# EAGLE design TouchPanel_ver _5 (EAGLE 6.1)
Master board. Prototype version 1.0
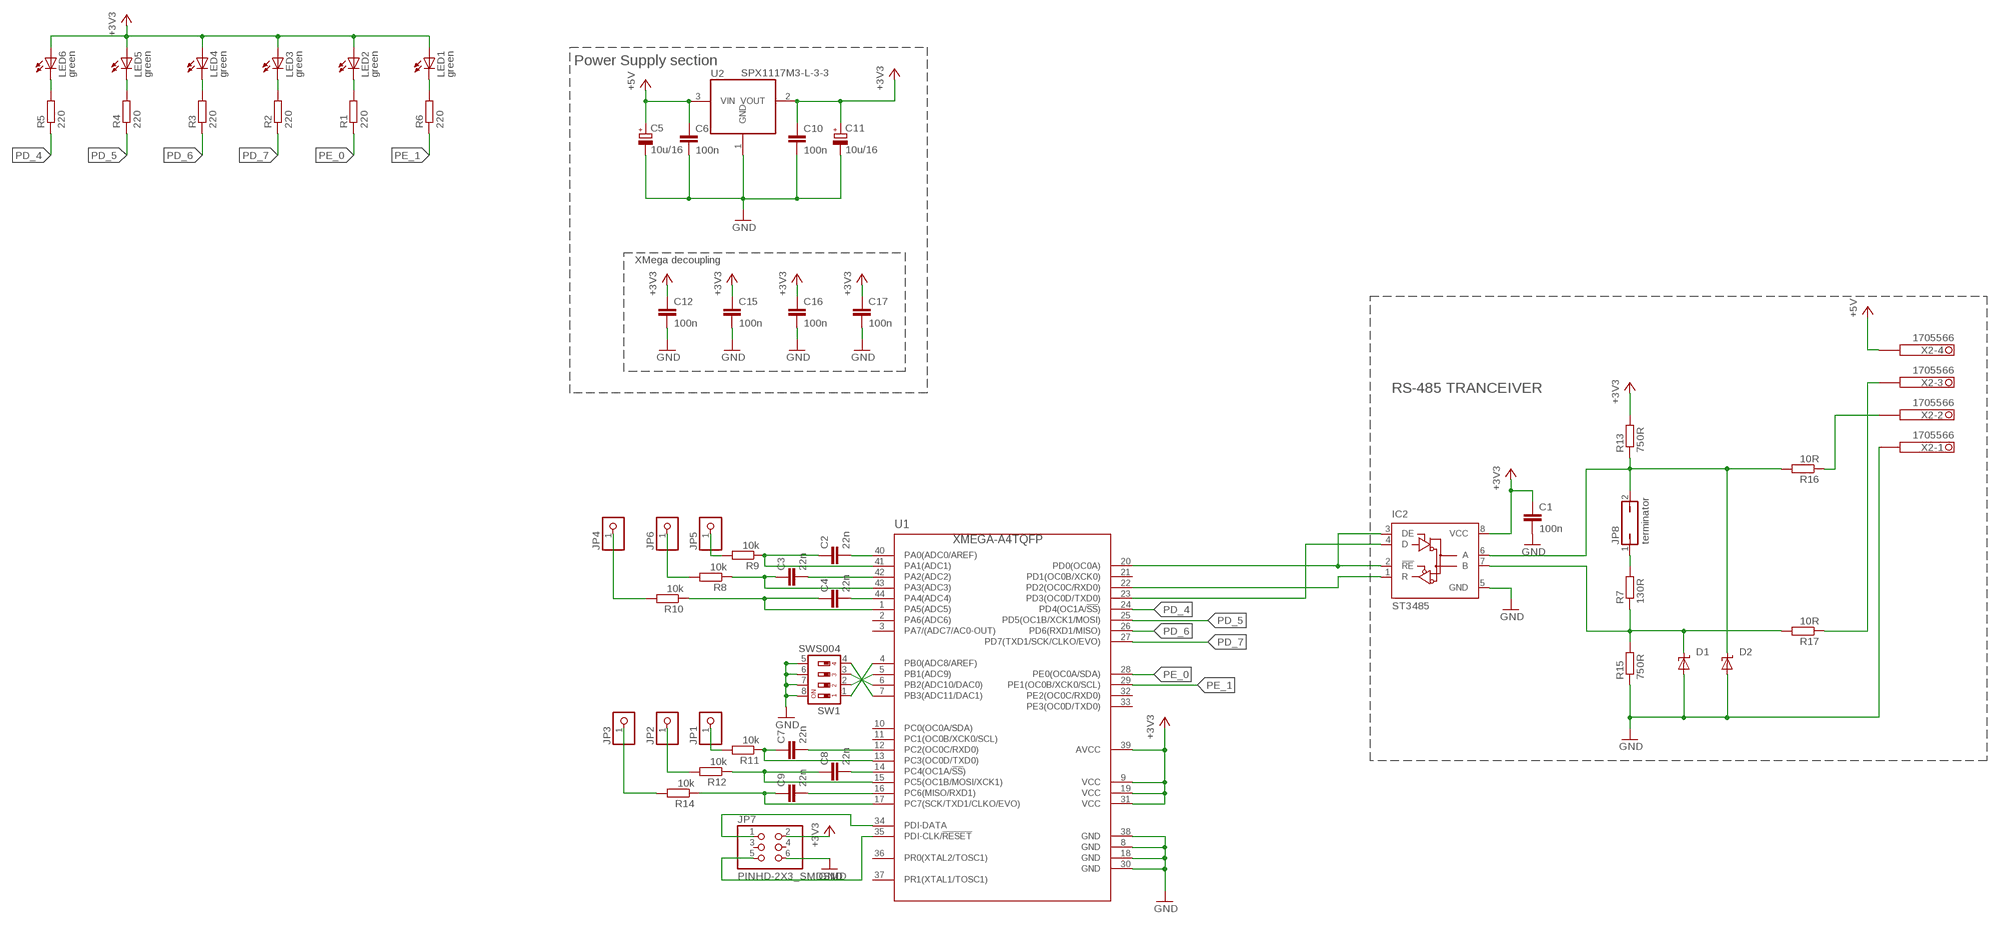
[diagram p0: schematic, sheet 1]

## Parts
C1  100n  C-EUC1206  [C1206]
C2  22n  C-EUC1206  [C1206]
C3  22n  C-EUC1206  [C1206]
C4  22n  C-EUC1206  [C1206]
C5  10u/16  CPOL-EUSMCB  [SMC_B]
C6  100n  C-EUC1206  [C1206]
C7  22n  C-EUC1206  [C1206]
C8  22n  C-EUC1206  [C1206]
C9  22n  C-EUC1206  [C1206]
C10  100n  C-EUC1206  [C1206]
C11  10u/16  CPOL-EUSMCB  [SMC_B]
C12  100n  C-EUC1206  [C1206]
C15  100n  C-EUC1206  [C1206]
C16  100n  C-EUC1206  [C1206]
C17  100n  C-EUC1206  [C1206]
D1  SUPPRESSOR-SMBJ  [SMBJ]
D2  SUPPRESSOR-SMBJ  [SMBJ]
IC2  ST3485  75176AD  [D_R-PDSO-G8]
JP1  PINHD-1X1  [1X01]
JP2  PINHD-1X1  [1X01]
JP3  PINHD-1X1  [1X01]
JP4  PINHD-1X1  [1X01]
JP5  PINHD-1X1  [1X01]
JP6  PINHD-1X1  [1X01]
JP7  PINHD-2X3_SMDSMD  [2X03_SMD]
JP8  terminator  JP1Q  [JP1]
LED1  green  LEDTOPLED-SANTANA  [MINI-TOPLED-SANTANA]
LED2  green  LEDTOPLED-SANTANA  [MINI-TOPLED-SANTANA]
LED3  green  LEDTOPLED-SANTANA  [MINI-TOPLED-SANTANA]
LED4  green  LEDTOPLED-SANTANA  [MINI-TOPLED-SANTANA]
LED5  green  LEDTOPLED-SANTANA  [MINI-TOPLED-SANTANA]
LED6  green  LEDTOPLED-SANTANA  [MINI-TOPLED-SANTANA]
R1  220  R-EU_M1206  [M1206]
R2  220  R-EU_M1206  [M1206]
R3  220  R-EU_R1206  [R1206]
R4  220  R-EU_R1206  [R1206]
R5  220  R-EU_R1206  [R1206]
R6  220  R-EU_M1206  [M1206]
R7  130R  R-EU_M1206  [M1206]
R8  10k  R-EU_R1206  [R1206]
R9  10k  R-EU_R1206  [R1206]
R10  10k  R-EU_R1206  [R1206]
R11  10k  R-EU_R1206  [R1206]
R12  10k  R-EU_R1206  [R1206]
R13  750R  R-EU_M1206  [M1206]
R14  10k  R-EU_R1206  [R1206]
R15  750R  R-EU_M1206  [M1206]
R16  10R  R-EU_M1206  [M1206]
R17  10R  R-EU_M1206  [M1206]
SW1  SWS004  [SMS-004]
U1  XMEGA-A4TQFP  [TQFP44]
U2  SPX1117M3-L-3-3  REG1117  [SOT223]
X2  1705566  [1705566]

## Nets
+3V3: C1.1 C10.1 C11.+ C12.1 C15.1 C16.1 C17.1 IC2.8(VCC) JP7.2 LED1.A LED2.A LED3.A LED4.A LED5.A LED6.A R13.2 U1.9(VCC) U1.19(VCC) U1.31(VCC) U1.39(AVCC) U2.2(VOUT)
+5V: C5.+ C6.1 U2.3(VIN) X2.4.2(-4:1B)
GND: C1.2 C5.- C6.2 C10.2 C11.- C12.2 C15.2 C16.2 C17.2 D1.A D2.A IC2.5(GND) JP7.6 R15.1 SW1.5 SW1.6 SW1.7 SW1.8 U1.8(GND) U1.18(GND) U1.30(GND) U1.38(GND) U2.1(GND) X2.1.2(-1:1B)
JP4: JP4.1 R10.2
N$1: LED2.C R1.2
N$2: LED3.C R2.2
N$3: LED4.C R3.2
N$4: LED5.C R4.2
N$5: LED6.C R5.2
N$6: R17.1 X2.3.2(-3:1B)
N$7: JP8.1 R7.2
N$8: R16.1 X2.2.2(-2:1B)
N$9: D1.C IC2.7(B) R7.1 R15.2 R17.2
N$10: JP7.1 U1.34(PDI-DATA)
N$11: JP7.5 U1.35(PDI-CLK/!RESET)
N$12: LED1.C R6.2
N$13: C2.1 R9.1 U1.41(PA1(ADC1))
N$14: C2.2 U1.40(PA0(ADC0/AREF))
N$15: C9.2 U1.16(PC6(MISO/RXD1))
N$16: C3.1 R8.1 U1.43(PA3(ADC3))
N$17: C8.2 U1.14(PC4(OC1A/!SS!))
N$18: C4.1 R10.1 U1.1(PA5(ADC5))
N$20: C7.2 U1.12(PC2(OC0C/RXD0))
N$21: C9.1 R14.1 U1.17(PC7(SCK/TXD1/CLKO/EVO))
N$22: SW1.1 U1.4(PB0(ADC8/AREF))
N$23: SW1.4 U1.7(PB3(ADC11/DAC1))
N$24: SW1.2 U1.5(PB1(ADC9))
N$25: SW1.3 U1.6(PB2(ADC10/DAC0))
N$26: C8.1 R12.1 U1.15(PC5(OC1B/MOSI/XCK1))
N$27: C3.2 U1.42(PA2(ADC2))
N$28: C7.1 R11.1 U1.13(PC3(OC0D/TXD0))
N$29: C4.2 U1.44(PA4(ADC4))
N$30: JP1.1 R11.2
N$31: JP2.1 R12.2
N$32: JP3.1 R14.2
N$33: JP6.1 R8.2
N$35: JP5.1 R9.2
PD_0: IC2.2(!RE) IC2.3(DE) U1.20(PD0(OC0A))
PD_2: IC2.1(R) U1.22(PD2(OC0C/RXD0))
PD_3: IC2.4(D) U1.23(PD3(OC0D/TXD0))
PD_4: R5.1 U1.24(PD4(OC1A/!SS!))
PD_5: R4.1 U1.25(PD5(OC1B/XCK1/MOSI))
PD_6: R3.1 U1.26(PD6(RXD1/MISO))
PD_7: R2.1 U1.27(PD7(TXD1/SCK/CLKO/EVO))
PE_0: R1.1 U1.28(PE0(OC0A/SDA))
PE_1: R6.1 U1.29(PE1(OC0B/XCK0/SCL))
RS485_A1: D2.C IC2.6(A) JP8.2 R13.1 R16.2
Unconnected: JP7.3 JP7.4 U1.2(PA6(ADC6)) U1.3(PA7/(ADC7/AC0-OUT)) U1.10(PC0(OC0A/SDA)) U1.11(PC1(OC0B/XCK0/SCL)) U1.21(PD1(OC0B/XCK0)) U1.32(PE2(OC0C/RXD0)) U1.33(PE3(OC0D/TXD0)) U1.36(PR0(XTAL2/TOSC1)) U1.37(PR1(XTAL1/TOSC1)) X2.1.1(-1:1A) X2.2.1(-2:1A) X2.3.1(-3:1A) X2.4.1(-4:1A)

## Notes on the sheet
- Power Supply section
- XMega decoupling
- RS-485 TRANCEIVER

## Library data of the parts
C1-C4 C6-C10 C12 C15-C17 = rcl:C-EU: CAPACITOR, European symbol
C5 C11 = rcl:CPOL-EU: POLARIZED CAPACITOR, European symbol
D1 D2 = diode:SUPPRESSOR-: Suppressor diode
IC2 = 751xx:75176A: DIFFERENTIAL BUS TRANSCEIVER Source: http://focus.ti.com/lit/ds/symlink/sn75176a.pdf
JP1-JP6 = pinhead:PINHD-1X1: PIN HEADER
JP7 = pinhead:PINHD-2X3_SMD
JP8 = jumper:JP1Q: JUMPER
LED1-LED6 = led:LED: LED OSRAM: - CHIPLED LG R971, LG N971, LY N971, LG Q971, LY Q971, LO R971, LY R971 LH N974, LH R974 LS Q976, LO Q976, LY Q976 LO Q996 - Hyper CHIPLED LW Q18S LB Q993, LB Q99A, LB R99A - SideLED LS A670, LO A670, LY A670, LG A670, LP A670 LB A673, LV A673, LT A673, LW A673 LH A674 LY A675 LS A676, LA A676, LO A676, LY A676, LW A676 LS A679, LY A679, LG A679 - Hyper Micro SIDELED® LS Y876, LA Y876, LO Y876, LY Y876 LT Y87S - SmartLED LW L88C, LW L88S LB L89C, LB L89S, LG L890 LS L89K, LO L89K, LY L89K LS L896, LA L896, LO L896, LY L896 - TOPLED LS T670, LO T670, LY T670, LG T670, LP T670 LSG T670, LSP T670, LSY T670, LOP T670, LYG T670 LG T671, LOG T671, LSG T671 LB T673, LV T673, LT T673, LW T673 LH T674 LS T676, LA T676, LO T676, LY T676, LB T676, LH T676, LSB T676, LW T676 LB T67C, LV T67C, LT T67C, LS T67K, LO T67K, LY T67K, LW E67C LS E67B, LA E67B, LO E67B, LY E67B, LB E67C, LV E67C, LT E67C LW T67C LS T679, LY T679, LG T679 LS T770, LO T770, LY T770, LG T770, LP T770 LB T773, LV T773, LT T773, LW T773 LH T774 LS E675, LA E675, LY E675, LS T675 LS T776, LA T776, LO T776, LY T776, LB T776 LHGB T686 LT T68C, LB T68C - Hyper Mini TOPLED® LB M676 - Mini TOPLED Santana® LG M470 LS M47K, LO M47K, LY M47K Source: http://www.osram.convergy.de LUXEON: - LUMILED® LXK2-PW12-R00, LXK2-PW12-S00, LXK2-PW14-U00, LXK2-PW14-V00 LXK2-PM12-R00, LXK2-PM12-S00, LXK2-PM14-U00 LXK2-PE12-Q00, LXK2-PE12-R00, LXK2-PE12-S00, LXK2-PE14-T00, LXK2-PE14-U00 LXK2-PB12-K00, LXK2-PB12-L00, LXK2-PB12-M00, LXK2-PB14-N00, LXK2-PB14-P00, LXK2-PB14-Q00 LXK2-PR12-L00, LXK2-PR12-M00, LXK2-PR14-Q00, LXK2-PR14-R00 LXK2-PD12-Q00, LXK2-PD12-R00, LXK2-PD12-S00 LXK2-PH12-R00, LXK2-PH12-S00 LXK2-PL12-P00, LXK2-PL12-Q00, LXK2-PL12-R00 Source: www.luxeon.com KINGBRIGHT: KA-3528ASYC Source: www.kingbright.com
R1-R17 = rcl:R-EU_: RESISTOR, European symbol
SW1 = smd-special:SWS004: SMD Dip Switch 4 pol.
U1 = avr-7:XMEGA-A4: Atmel XMega A4 series processor
U2 = burr-brown:REG1117: 800mA and 1A Low Dropout (LDO) Positive Regulator 1.8V, 2.5V, 2.85V, 3.3V, 5V, and Adj; MPN: REG1117; OC_FARNELL: 1097566; OC_NEWARK: 14P6981
X2 = con-phoenix-3.81:1705566: MKDSD 1,5/ 4-3,81 Printklemme Nennstrom: 8 A Bemessungsspannung: 200 V Raster: 3,81 mm Polzahl: 4 Montageart: Löten Anschlussart: Schraubanschluss Anschlussrichtung vom Leiter zur Platine: 0° Source: http://eshop.phoenixcontact.com .. 1705566.pdf; OC_FARNELL: unknown; OC_NEWARK: unknown

## Board
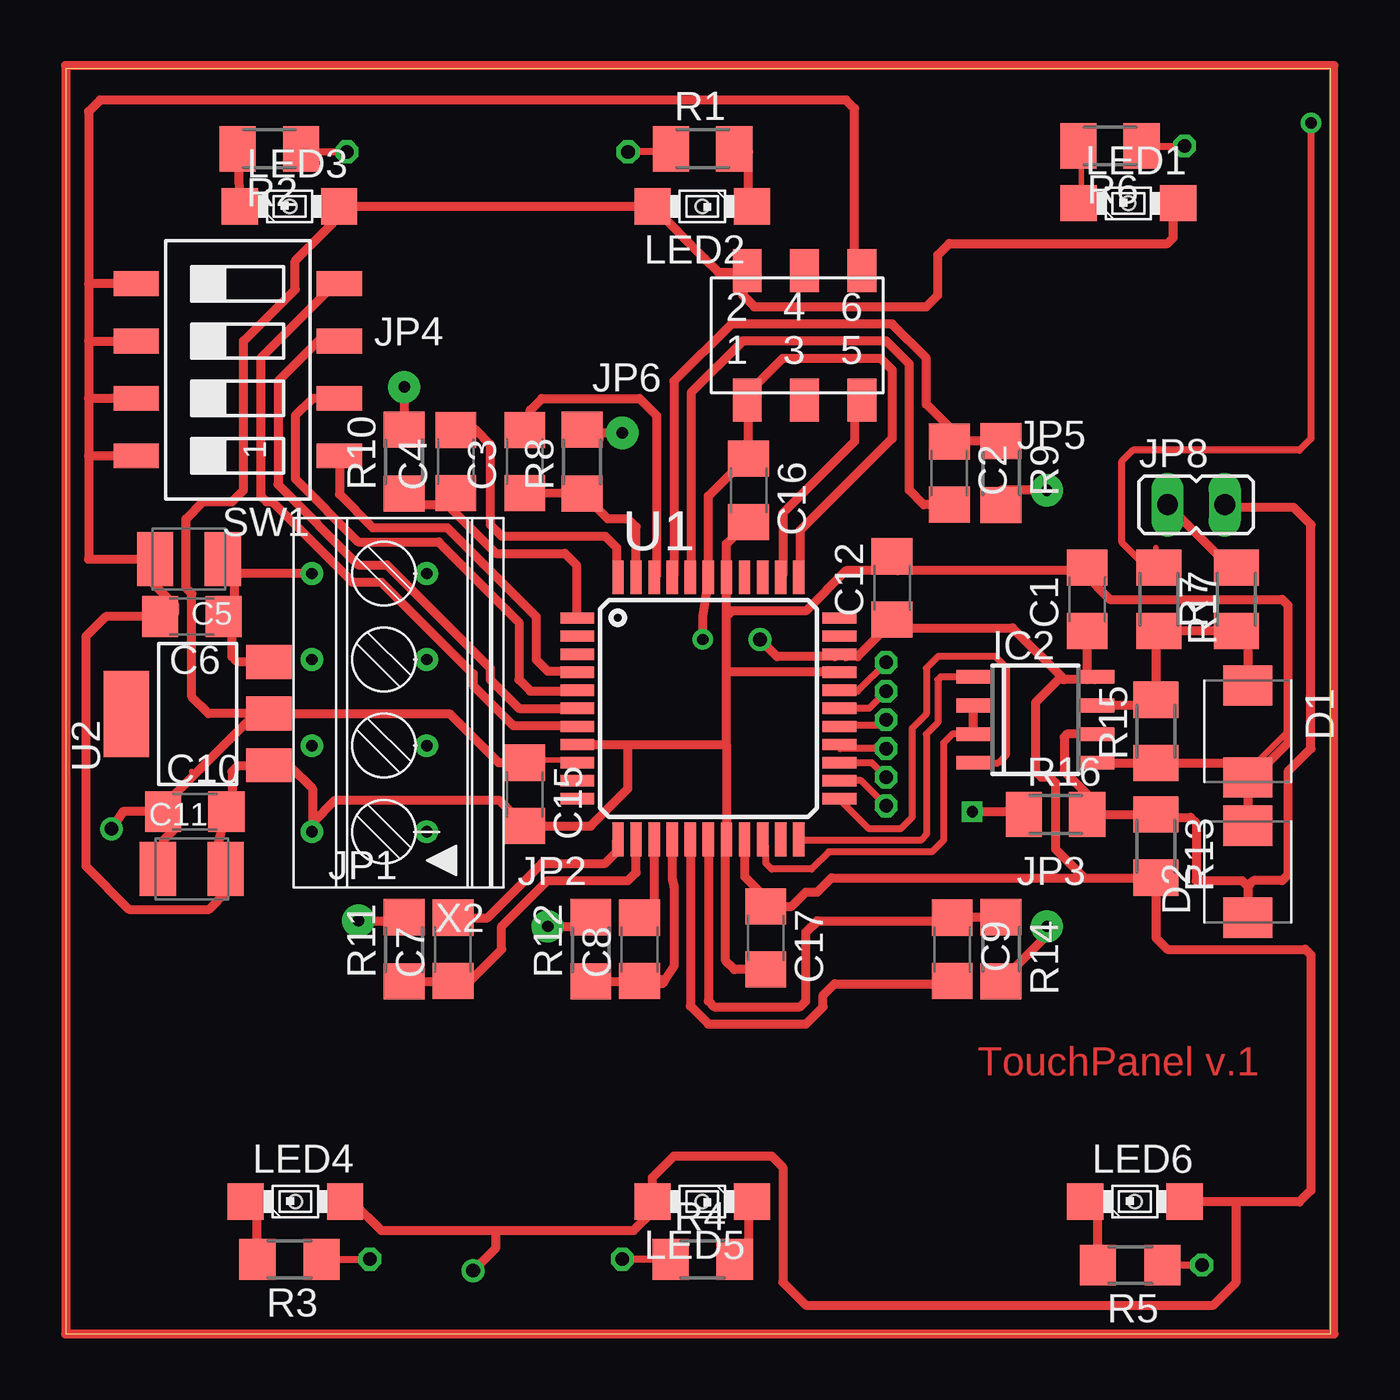
[diagram p1: board, top side]
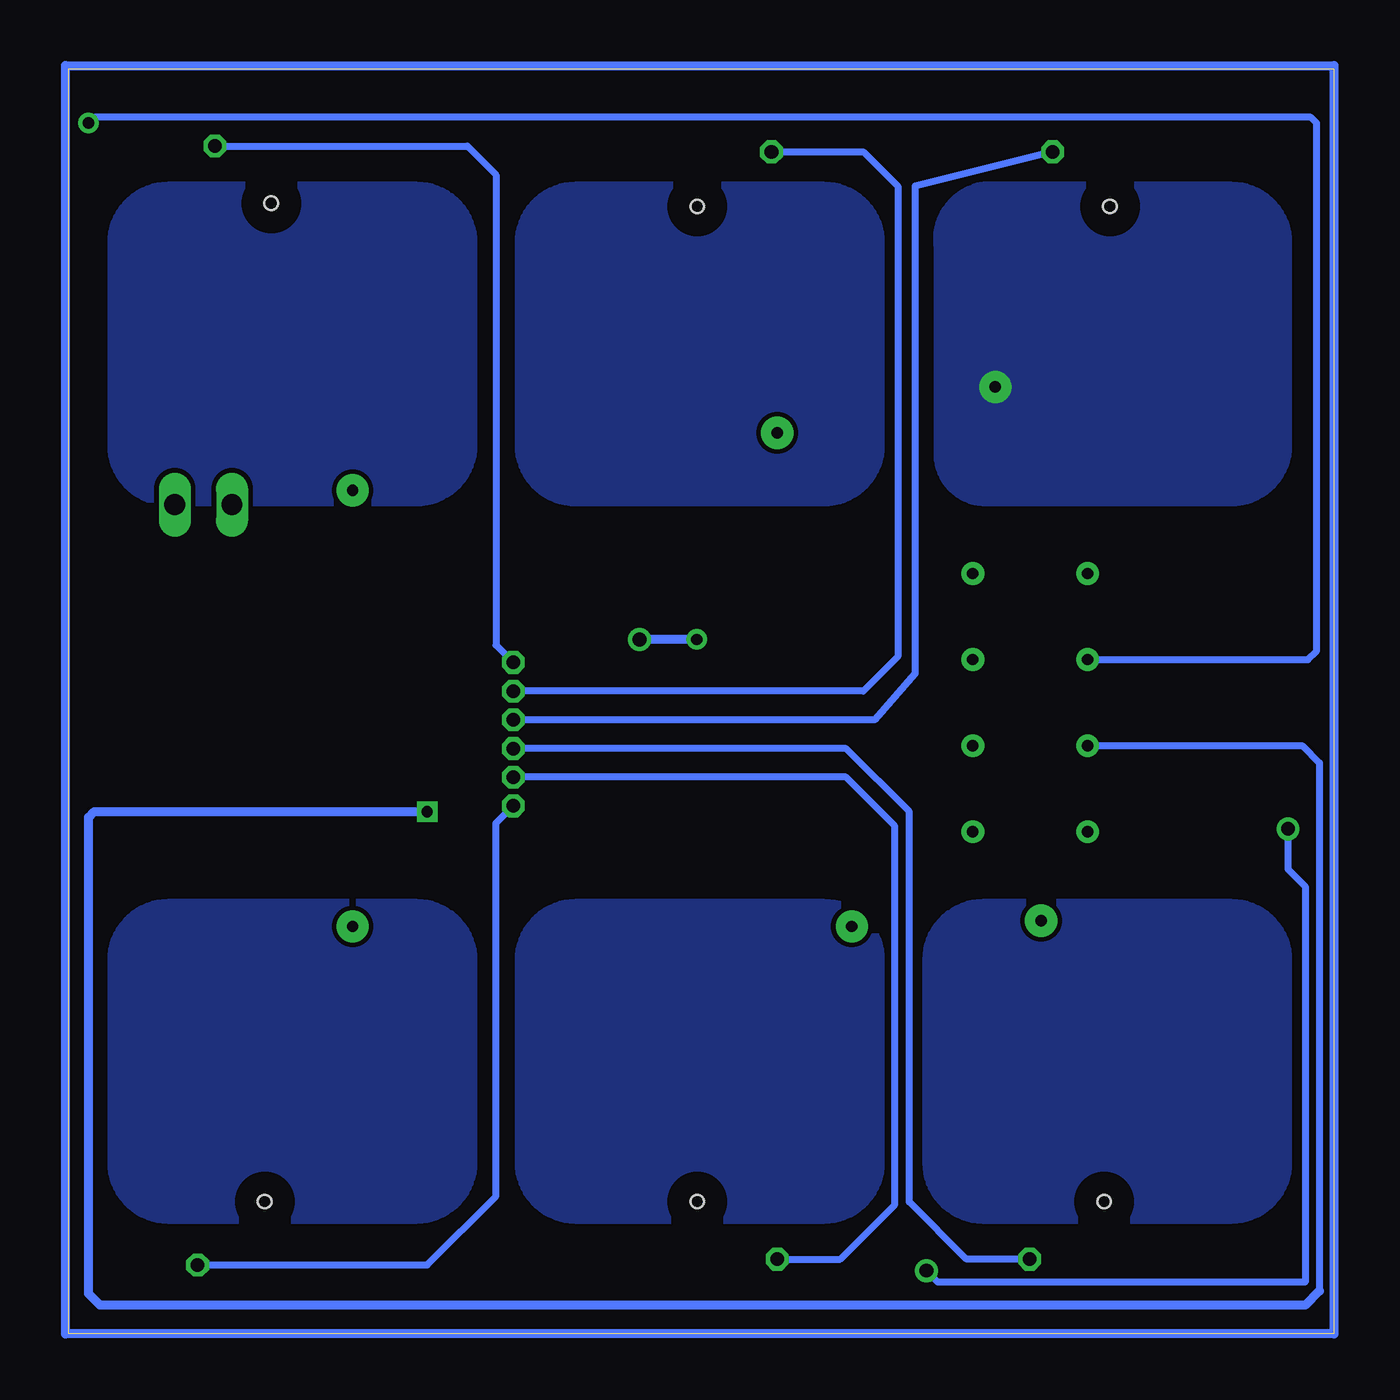
[diagram p2: board, bottom side, seen from below]

Size 56 x 56 mm. Coordinates in mm from the lower left corner, seen from the top.
Outline: 0,0 56,0 56,56 0,56 0,0
Copper layers (1*16): Top 0.035mm / dielectric 1.5mm / Bottom 0.035mm
Design rules: minimum track width 10mil, minimum drill 24mil, track to track 8mil, track to pad 8mil, pad to pad 8mil, via to via 8mil, smd to smd 8mil, copper to edge 40mil, drill to drill 8mil, minimum pad ring 10mil, minimum via ring 8mil, stop-mask expansion 4mil, vias tented up to drill 0mil, thermal gap 10mil

### Footprints (pad centres in the part's own frame; a part is rotated, then mirrored left to right if it is on the bottom)
C1206 = smd 1.6 x 1.8: 1 -1.4,0; 2 1.4,0
SMC_B = smd 1.6 x 2.4: + -1.5,0; - 1.5,0
SMBJ = smd 1.78 x 2.16: A 2.04,0; C -2.03,0
D_R-PDSO-G8 = smd 0.6 x 1.5: 1 -1.905,-2.75; 2 -0.635,-2.75; 3 0.635,-2.75; 4 1.905,-2.75; 5 1.905,2.75; 6 0.635,2.75; 7 -0.635,2.75; 8 -1.905,2.75
1X01 = drill 0.5 pad 1.422: 1 0,0
2X03_SMD = smd 0.635 x 1.27: 1 0.635,-1.27; 2 0.635,3.81; 3 3.175,-1.27; 4 3.175,3.81; 5 5.715,-1.27; 6 5.715,3.81; P$1 1.27,3.81; P$2 3.81,3.81; P$3 6.35,3.81; P$4 1.27,-1.27; P$5 3.81,-1.27; P$6 6.35,-1.27; P$7 6.35,4.445; P$8 5.715,4.445; P$9 3.81,4.445; P$10 3.175,4.445; P$11 1.27,4.445; P$12 0.635,4.445; P$13 0.635,-1.905; P$14 1.27,-1.905; P$15 3.175,-1.905; P$16 3.81,-1.905; P$17 5.715,-1.905; P$18 6.35,-1.905
JP1 = drill 0.914 long: 1 0,-1.27; 2 0,1.27
MINI-TOPLED-SANTANA = smd 1.6 x 1.6: A 0,2.2; C 0,-2.2 | hole 0.6: 0,0
M1206 = smd 1.6 x 2: 1 -1.4,0; 2 1.4,0
R1206 = smd 1.6 x 1.803: 1 -1.422,0; 2 1.422,0
SMS-004 = smd 1.092 x 2.007: 1 -3.81,-4.496; 2 -1.27,-4.496; 3 1.27,-4.496; 4 3.81,-4.496; 5 3.81,4.496; 6 1.27,4.496; 7 -1.27,4.496; 8 -3.81,4.496
TQFP44 = smd 1.5 x 0.5: 1 -5.8,4; 2 -5.8,3.2; 3 -5.8,2.4; 4 -5.8,1.6; 5 -5.8,0.8; 6 -5.8,0; 7 -5.8,-0.8; 8 -5.8,-1.6; 9 -5.8,-2.4; 10 -5.8,-3.2; 11 -5.8,-4; 23 5.8,-4; 24 5.8,-3.2; 25 5.8,-2.4; 26 5.8,-1.6; 27 5.8,-0.8; 28 5.8,0; 29 5.8,0.8; 30 5.8,1.6; 31 5.8,2.4; 32 5.8,3.2; 33 5.8,4 | smd 0.5 x 1.5: 12 -4,-5.8; 13 -3.2,-5.8; 14 -2.4,-5.8; 15 -1.6,-5.8; 16 -0.8,-5.8; 17 0,-5.8; 18 0.8,-5.8; 19 1.6,-5.8; 20 2.4,-5.8; 21 3.2,-5.8; 22 4,-5.8; 34 4,5.8; 35 3.2,5.8; 36 2.4,5.8; 37 1.6,5.8; 38 0.8,5.8; 39 0,5.8; 40 -0.8,5.8; 41 -1.6,5.8; 42 -2.4,5.8; 43 -3.2,5.8; 44 -4,5.8
SOT223 = smd 1.499 x 2.007: 1 -2.261,-3.15; 2 0.025,-3.15; 3 2.311,-3.15 | smd 3.81 x 2.007: 4 0,3.15
1705566 = drill 0.5 pad 0.9: 1.1 -5.715,-1.25; 1.2 -5.715,3.83; 2.1 -1.905,-1.25; 2.2 -1.905,3.83; 3.1 1.905,-1.25; 3.2 1.905,3.83; 4.1 5.715,-1.25; 4.2 5.715,3.83

### Placement (x,y rotation side)
C1  45.21,32.51 90 top
C2  39.12,38.1 270 top
C3  20.32,38.61 90 top
C4  17.27,38.61 90 top
C5  5.46,34.29 180 top
C6  5.59,31.75 180 top
C7  17.14,17.02 90 top
C8  25.4,17.02 90 top
C9  39.24,17.02 270 top
C10  5.71,23.11 0 top
C11  5.59,20.57 0 top
C12  36.58,33.02 90 top
C15  20.32,23.88 270 top
C16  30.23,37.34 270 top
C17  30.99,17.53 270 top
D1  52.32,26.67 270 top
D2  52.32,20.45 90 top
IC2  42.93,27.18 270 top
JP1  12.95,18.29 0 top
JP2  21.34,18.03 0 top
JP3  43.43,18.03 0 top
JP4  14.99,41.91 0 top
JP5  43.43,37.34 0 top
JP6  24.64,39.88 0 top
JP7  29.21,42.93 0 top
JP8  50.04,36.7 270 top
LED1  47.04,50.04 270 top
LED2  28.17,49.91 90 top
LED3  9.91,49.91 270 top
LED4  10.17,5.85 270 top
LED5  28.17,5.85 90 top
LED6  47.33,5.85 270 top
R1  28.19,52.45 0 top
R2  9.02,52.45 180 top
R3  9.91,3.3 180 top
R4  28.19,3.3 0 top
R5  47.12,3.05 180 top
R6  46.23,52.58 180 top
R7  51.82,32.51 90 top
R8  22.86,38.61 90 top
R9  41.4,38.1 270 top
R10  14.99,38.61 90 top
R11  14.99,17.02 90 top
R12  23.24,17.02 90 top
R13  48.26,21.59 270 top
R14  41.4,17.02 270 top
R15  48.26,26.67 90 top
R16  43.81,22.99 0 top
R17  48.39,32.51 270 top
SW1  7.62,42.67 90 top
U1  28.45,27.69 0 top
U2  5.84,27.43 90 top
X2  14.73,27.94 90 top

### Tracks (layer width: path | path; a pad name or v marks a point on that pad's centre or on a via)
+3V3  (via drill 0.5, 0.6, 0.6 pad 0.25)
  Top 0.254: 20.32,25.4 20.19,25.27 | 30.23,38.86 C16.1 | 34.54,29.97 34.29,29.97 U1.31 | 45.21,28.96 IC2.8 | 4.32,23.37 C10.1 | 11.94,49.78 LED3.A | 5.59,24.89 5.71,24.77 | 20.32,25.4 22.61,25.4 U1.9 | 20.32,25.4 C15.1 | 9.14,27.43 U2.2 | 28.19,47.5 28.29,47.59
  Top 0.305: 11.94,49.28 11.94,49.73 LED3.A
  Top 0.406: 45.72,29.13 IC2.8 45.55,28.96 45.21,28.96 | C1.1 45.21,28.96 | 45.21,28.96 44.2,28.96 | 45.09,20.19 43.81,21.46 43.81,24.38 43.56,24.64 43.18,24.64 42.93,24.89 42.93,27.94 43.94,28.96 44.2,28.96 | 45.09,20.19 R13.2 48.26,17.53 48.77,17.02 54.86,17.02 55.12,16.76 55.12,6.35 54.61,5.84 51.82,5.84 | 44.2,28.96 41.91,31.24 37.4,31.24 C12.1 36.45,31.37 35.05,29.97 34.54,29.97 | 51.82,5.84 LED6.A | C11.+ 4.32,20.8 4.32,21.84 4.76,22.29 C10.1 2.54,23.11 v2.03,22.35 | 22.61,25.15 22.65,25.19 U1.9 22.64,25.28 | 20.19,25.27 20.32,25.15 | U1.19 30.05,20.24 30.73,19.56 30.73,19.18 C17.1 32.13,18.93 32.77,19.56 33.27,19.56 33.91,20.19 45.09,20.19 | LED3.A LED2.A 28.29,47.59 28.89,46.99 29.97,46.99 29.97,46.74 | 30.23,41.15 30.23,38.86 28.45,37.08 U1.39 28.19,31.75 v28.19,30.73 | 29.97,46.74 29.97,45.97 30.48,45.47 38.1,45.47 38.61,45.97 38.61,47.75 39.12,48.26 48.77,48.26 49.02,48.51 49.02,49.83 LED1.A | LED4.A 12.69,5.85 13.97,4.57 19.05,4.57 | 19.05,4.57 25.15,4.57 25.97,5.4 LED5.A 25.97,6.92 26.92,7.87 31.24,7.87 31.75,7.37 31.75,2.29 32.77,1.27 50.8,1.27 51.82,2.29 51.82,5.84 | v30.73,30.73 31.5,29.97 34.04,29.97 U1.31 | v18.03,2.79 19.05,3.81 19.05,4.57 | 4.32,23.36 4.32,23.37 5.71,24.77 8.41,27.46 U2.2 6.33,27.46 5.59,28.19 5.59,32.77 5.33,33.02 5.33,36.07 6.1,36.83 7.37,36.83 7.87,37.34 7.87,43.94 10.16,46.23 10.16,47.5 11.94,49.28 | JP7.2 29.97,46.74 | C15.1 19.17,25.28 17.02,27.43 9.14,27.43 8.64,27.43
  Bottom 0.305: v2.03,22.35 2.03,20.57 1.27,19.81 1.27,2.29 17.53,2.29 v18.03,2.79
  Bottom 0.406: v28.19,30.73 v30.73,30.73
+5V
  Top 0.406: U2.3 7.59,29.74 7.37,29.97 7.37,30.99 6.73,31.62 | 6.73,31.62 6.6,31.75 | X2.4.2 7.47,33.66 | 7.47,33.66 C5.+ | 7.47,33.66 7.47,32.23 C6.1 6.86,31.75 6.73,31.62
GND
  Top 0.254: 54.1,26.67 52.32,24.89 D1.A
  Top 0.406: IC2.5 48.77,25.27 R15.1 51.68,25.27 D1.A D2.A | C1.2 45.08,33.78 | 45.08,33.78 36.83,33.78 | 53.09,25.15 54.1,26.16 54.1,26.67 54.1,32.26 53.85,32.51 46.23,32.51 45.08,33.66 45.08,33.78 | 8.97,25.15 U2.1 | 8.97,25.15 7.62,25.15 7.37,24.89 7.37,23.82 C10.2 6.67,21.4 6.6,21.34 6.86,21.08 6.86,20.83 7.09,20.6 | C6.2 4.83,31.94 4.83,32.26 3.83,33.25 C5.- 1.02,34.29 1.02,38.86 | C6.2 4.57,31.75 | SW1.5 1.02,46.48 | 1.02,46.48 1.02,43.94 | 1.02,43.94 SW1.6 | 1.02,43.94 1.02,41.4 | SW1.7 1.02,41.4 | 1.02,41.4 1.02,38.86 | SW1.8 1.02,38.86 | C16.2 29.25,34.96 U1.38 29.25,31.75 | 22.6,26.04 U1.8 24.89,26.09 | 24.89,26.09 29.25,26.09 | 29.25,26.09 U1.18 29.21,21.85 29.21,16.51 29.59,16.13 C17.2 | 29.25,26.09 29.25,29.29 | 29.25,29.29 29.25,31.75 | U1.30 29.25,29.29 | 24.89,26.09 24.89,24.13 23.24,22.48 C15.2 19.17,23.62 11.94,23.62 10.9,22.59 X2.1.2 10.92,22.25 10.92,24.13 9.91,25.15 8.97,25.15 | C6.2 1.78,31.75 0.89,30.86 0.89,20.7 2.79,18.8 6.35,18.8 7.11,19.56 7.11,20.55 C11.- 7.09,20.6 | JP7.6 34.92,54.23 34.54,54.61 1.52,54.61 1.02,54.1 1.02,46.48 | C12.2 36.83,33.78 | 7.09,20.6 7.11,20.57 6.6,20.57 | 36.83,33.78 34.54,33.78 32.77,32 29.46,32 29.46,31.97 29.25,31.75
JP4
  Top 0.406: JP4.1 R10.2
  pour Bottom: 4.53,50.8 15.53,50.8 arc-90 17.52,48.04 17.52,39.08 arc-90 15.53,36.83 4.53,36.83 arc-90 2.03,39.33 2.03,48.3 arc-90
N$1
  Top 0.406: LED2.C 30.23,50.05 30.23,52.32 30.1,52.45 R1.2
N$2
  Top 0.406: R2.2 LED3.C
N$3
  Top 0.406: R3.2 8.48,5.33 LED4.C
N$4
  Top 0.254: 30.23,3.81 29.72,3.3 R4.2
  Top 0.406: LED5.C 30.23,5.7 30.23,3.81 30.23,3.56
N$5
  Top 0.254: 45.47,5.59 45.21,5.84 LED6.C
  Top 0.406: R5.2 45.7,5.36 45.47,5.59
N$6  (via drill 0.5)
  Top 0.254: 48.26,34.8 48.26,34.04 | 47.75,34.04 48.26,34.04 | 48.26,34.04 R17.1
  Top 0.305: v55.12,53.59 55.12,39.62 54.61,39.12 47.24,39.12 46.74,38.61 46.74,35.05 47.75,34.04
  Top 0.406: R17.1
  Bottom 0.305: X2.3.2 1.14,29.84 0.76,30.23 0.76,53.59 1.02,53.85 54.86,53.85 v55.12,53.59
N$7
  Top 0.406: R7.2 51.56,33.91 JP8.1
N$8  (via drill 0.5)
  Top 0.254: R16.1 42.42,23.11 42.29,22.99
  Top 0.406: v40.13,23.11 42.16,23.11 42.29,22.99 42.42,22.86 42.42,23.11
  Bottom 0.305: X2.2.2 1.4,26.04 0.64,25.27 0.64,1.91
  Bottom 0.406: 0.64,1.91 1.27,1.27 54.61,1.27 55.12,1.78 55.12,22.86 54.86,23.11 v40.13,23.11
N$9
  Top 0.406: 48.9,28.2 R15.2 | R15.2 47.88,28.07 47.62,27.81 IC2.7 | D1.C 52.32,30.6 R7.1 R17.2 48.26,30.98 R15.2
N$10
  Top 0.406: JP7.1 30.23,41.66 31.75,43.18 36.07,43.18 36.58,42.67 36.58,39.62 32.51,35.56 32.51,33.55 U1.34
N$11
  Top 0.406: JP7.5 34.92,39.5 31.75,36.32 31.75,33.59 U1.35
N$12
  Top 0.254: LED1.C 44.96,50.29 44.96,52.58 R6.2
N$13
  Top 0.406: R9.1 39.14,39.52 C2.1 39.12,40.13 38.1,41.15 38.1,43.18 36.58,44.7 29.46,44.7 26.92,42.16 26.92,33.56 U1.41
N$14
  Top 0.406: C2.2 37.98,36.7 37.34,37.34 37.34,42.93 36.32,43.94 29.97,43.94 27.69,41.66 27.69,33.52 U1.40
N$15
  Top 0.406: U1.16 27.65,14.52 28.45,13.72 32.77,13.72 33.53,14.48 33.53,14.99 34.04,15.49 39.12,15.49 C9.2
N$16
  Top 0.406: C3.1 R8.1 24,36.07 24.89,36.07 25.25,35.71 U1.43
N$17
  Top 0.406: U1.14 26.05,18.81 C8.2
N$18
  Top 0.406: 17,36.68 C4.1 | 17,36.68 15.49,36.68 R10.1 | 17,36.68 17,36.6 19.05,34.54 22.1,34.54 22.61,34.04 22.61,31.73 U1.1
N$19
  Bottom 0.406: 0,0 56.13,0 56.13,56.13 0,56.13 0,0
N$20
  Top 0.406: C7.2 18.67,18.42 21.08,20.83 23.88,20.83 24.38,21.34 24.38,21.82 U1.12
N$21
  Top 0.254: 39.37,18.29 C9.1
  Top 0.406: R14.1 39.27,18.44 C9.1 | U1.17 28.45,14.73 28.7,14.48 32.51,14.48 32.77,14.73 32.77,17.78 33.27,18.29 39.37,18.29
N$22
  Top 0.406: SW1.1 12.12,37.16 13.59,35.69 16.89,35.69 20.83,31.75 20.83,29.84 21.34,29.34 22.6,29.34 U1.4
N$23
  Top 0.406: SW1.4 11.94,46.48 8.64,43.18 8.64,37.08 8.89,36.83 9.14,36.83 12.7,33.27 13.97,33.27 18.03,29.21 18.03,28.7 19.81,26.92 22.61,26.92 U1.7
N$24
  Top 0.406: SW1.2 10.92,41.4 10.16,40.64 10.16,37.85 12.95,35.05 16.51,35.05 20.07,31.5 20.07,28.96 20.57,28.45 22.61,28.45 U1.5
N$25
  Top 0.406: SW1.3 11.18,43.94 9.4,42.16 9.4,37.59 12.95,34.04 14.22,34.04 18.8,29.46 18.8,28.96 20.07,27.69 U1.6
N$26
  Top 0.254: C8.1 25.65,15.75 26.42,15.75 26.53,15.67
  Top 0.406: R12.1 25.65,15.6 C8.1 | U1.15 26.85,20.14 26.92,19.81 26.92,16.26 26.53,15.67 26.42,15.49
N$27
  Top 0.406: C3.2 20.57,40.89 21.08,41.4 25.4,41.4 26.16,40.64 26.16,33.6 U1.42
N$28
  Top 0.406: R11.1 17.14,15.6 C7.1 17.9,15.62 19.3,17.02 19.3,18.03 21.34,20.07 24.89,20.07 25.25,20.42 U1.13
N$29
  Top 0.406: C4.2 18.16,40.01 18.8,39.37 18.8,35.81 19.3,35.31 23.88,35.31 24.38,34.8 24.38,33.55 U1.44
N$30
  Top 0.254: 14.99,18.29 R11.2
  Top 0.406: JP1.1 14.99,18.29
N$31
  Top 0.254: 23.11,18.03 23.11,18.29 R12.2
  Top 0.406: JP2.1 23.11,18.03
N$32
  Top 0.406: JP3.1 43.43,17.63 R14.2
N$33
  Top 0.254: 23.11,39.88 22.86,39.88 R8.2
  Top 0.406: 23.62,39.62 22.73,39.62 R8.2 | JP6.1 23.11,39.88
N$34
  Top 0.406: 0,0 56.13,0 56.13,56.13 0,56.13 0,0
N$35
  Top 0.406: JP5.1 41.4,37.34 R9.2
N$36  (via drill 0.6)
  other vias: 12.45,52.32
P1
  pour Bottom (no thermals): 4.53,19.05 15.53,19.05 arc-90 18.03,16.55 18.03,7.58 arc-90 15.53,5.08 4.53,5.08 arc-90 2.03,7.58 2.03,16.55 arc-90
P2
  pour Bottom: 36.07,16.55 36.07,7.58 arc-90 33.57,5.08 22.57,5.08 arc-90 20.07,7.58 20.07,16.55 arc-90 22.57,19.05 33.57,19.05 arc-90
P3
  pour Bottom: 38.1,7.58 38.1,16.55 arc-90 40.6,19.05 51.6,19.05 arc-90 54.1,16.55 54.1,7.58 arc-90 51.6,5.08 40.6,5.08 arc-90
P5
  pour Bottom: 22.57,50.8 33.57,50.8 arc-90 36.07,48.3 36.07,39.33 arc-90 33.57,36.83 22.57,36.83 arc-90 20.07,39.33 20.07,48.3 arc-90
P6
  pour Bottom: 51.6,36.83 40.6,36.83 arc-90 38.1,39.33 38.1,48.3 arc-90 40.6,50.8 51.6,50.8 arc-90 54.1,48.3 54.1,39.33 arc-90
PD_0
  Top 0.254: 30.99,21.59 30.99,21.84 U1.20
  Top 0.305: IC2.3 39.24,26.54 38.86,26.16 38.86,21.84 38.35,21.34 33.78,21.34 33.02,20.57 31.24,20.57 30.99,20.83 30.99,21.59
  Top 0.406: IC2.3 IC2.2
PD_2
  Top 0.305: IC2.1 38.73,29.08 38.61,28.96 38.61,27.05 38.1,26.54 38.1,22.1 37.85,21.84 32.49,21.84
  Top 0.406: 32.49,21.84 U1.22
PD_3
  Top 0.305: IC2.4 41.27,25.27 41.66,25.65 41.66,29.46 41.15,29.97 38.61,29.97 38.1,29.46 38.1,27.43 37.47,26.8 37.47,22.86 36.96,22.35 35.56,22.35 34.25,23.66
  Top 0.406: 34.25,23.66 U1.23
PD_4  (via drill 0.6)
  Top 0.305: R5.1 v50.29,3.05 | v36.32,23.37 35.2,24.49 U1.24
  Bottom 0.305: v50.29,3.05 40.13,3.05 37.08,6.1 37.08,22.61 v36.32,23.37
PD_5  (via drill 0.6)
  Top 0.254: 34.29,25.4 U1.25
  Top 0.305: R4.1 v24.64,3.3 | v36.32,24.64 35.69,25.27 34.29,25.27 34.29,25.4
  Bottom 0.305: v24.64,3.3 21.84,3.3 19.43,5.71 19.43,22.48 21.59,24.64 v36.32,24.64
PD_6  (via drill 0.6)
  Top 0.254: 34.29,26.16 U1.26
  Top 0.305: R3.1 v13.46,3.3 | v36.32,25.91 34.29,25.91 34.16,26.04 34.29,26.16
  Bottom 0.305: v13.46,3.3 16.26,3.3 18.8,5.84 18.8,23.11 21.59,25.91 v36.32,25.91
PD_7  (via drill 0.6)
  Top 0.254: 34.29,26.92 U1.27
  Top 0.305: R2.1 10.54,52.32 v12.45,52.32 | v36.32,27.18 36.07,26.92 34.29,26.92
  Bottom 0.305: v12.45,52.32 18.54,50.8 18.54,29.21 20.32,27.18 v36.32,27.18
PE_0  (via drill 0.6)
  Top 0.254: 34.29,27.69 U1.28
  Top 0.305: R1.1 26.67,52.32 v24.89,52.32 | v36.32,28.45 35.56,27.69 34.29,27.69
  Bottom 0.305: v24.89,52.32 20.83,52.32 19.3,50.8 19.3,29.97 20.83,28.45 v36.32,28.45
PE_1  (via drill 0.6)
  Top 0.254: 34.29,28.45 U1.29
  Top 0.305: R6.1 v49.53,52.58 | v36.32,29.72 35.05,28.45 34.29,28.45
  Bottom 0.305: v49.53,52.58 38.35,52.58 37.08,51.31 37.08,30.48 v36.32,29.72
RS485_A1
  Top 0.406: IC2.6 44.32,26.54 44.2,26.42 44.2,24.89 45.22,23.87 45.22,23.11 | 45.22,23.11 R16.2 R13.1 48.26,22.86 49.78,22.86 50.04,22.61 50.04,20.07 52.07,20.07 52.32,19.81 | 45.22,23.11 45.21,23.11 | 52.32,19.81 D2.C | 52.32,19.81 52.58,20.07 53.85,20.07 54.1,20.32 54.1,24.89 55.12,25.91 55.12,35.81 54.36,36.58 51.44,36.58 JP8.2

### Text on the board
Top: TouchPanel v.1